# Altium schematic sheet PWR_REVE.SchDoc
size A4; SheetNumber: 1; SheetTotal: 2
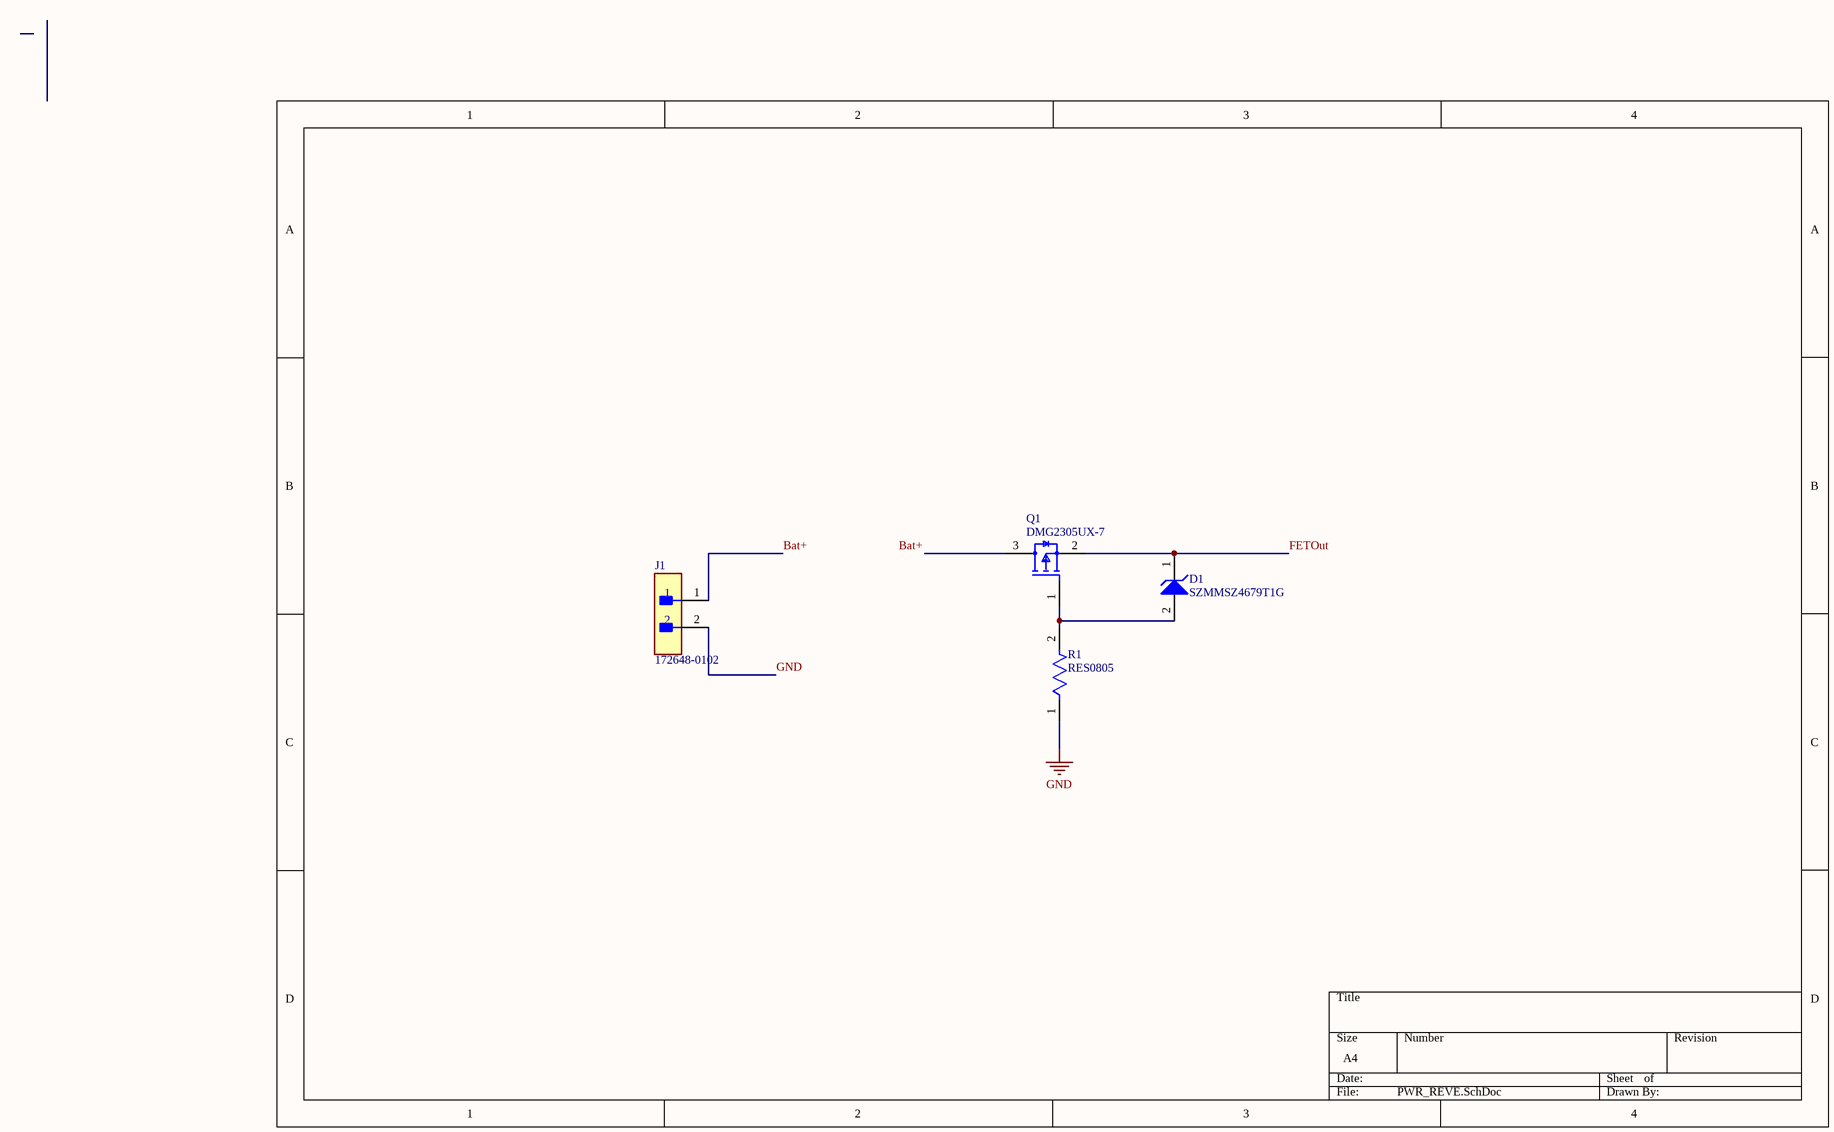
[diagram p0: PWR_REVE.SchDoc]

## Parts
D1  SZMMSZ4679T1G  [ONSC-SOD-123-2-425-04_V]
J1  172648-0102  [FP-172648-0102-MFG]
Q1  DMG2305UX-7  [FP-SOT23-IPC_B]
R1  RES0805  [FP-RMCF0805-IPC_C]

## Nets
GND: J1.2 R1.1
Bat+: J1.1 Q1.3(DRAIN)
FETOut: D1.1(K) Q1.2(SOURCE)
NetD1_2: D1.2(A) Q1.1(GATE) R1.2

## Library data of the parts
D1 = CMP-1060-00472-1: Zener Voltage Regulator, 500 mW, 2-Pin SOD-123, Pb-Free, Tape and Reel; Manufacturer: On Semiconductor; P Max (W): 0.5; VZ Typ (V): 2; ComponentLink3Description: Package Specification; Mounting Technology: Surface Mount; ComponentLink1URL: http://www.onsemi.com/; PackageVersion: Rev. G, 10/2009; ComponentLink3URL: http://www.onsemi.com/pub_link/Collateral/425-04.PDF; ComponentLink1Description: Manufacturer URL; ComponentLink2Description: Datasheet; PackageReference: SOD-123-2-425-04; PackageDescription: 2-Pin SOD, Body 1.6 x 2.69 mm; DatasheetVersion: Rev. 9; PartNumber: SZMMSZ4679T1G; ComponentLink2URL: http://www.onsemi.com/pub_link/Collateral/MMSZ4678T1-D.PDF; Packing: Tape and Reel; RoHS: Pb-Free
J1 = CMP-04776-000216-1: CONN HEADER R/A 2POS 4.2MM
Q1 = CMP-1693-00002-4: MOSFET P-CH 20V 4.2A SOT23; Turn-On Delay Time: 10.8ns; Turn-Off Delay Time: 79.3ns; Threshold Voltage: -900mV; Rise Time: 13.7ns; Gate to Source Voltage (Vgs): 8V; Rds On Max: 52mR; Element Configuration: Single; Fall Time: 34.7ns; Max Power Dissipation: 1.4W; Drain to Source Resistance: 200mR; Number of Channels: 1; Input Capacitance: 808pF; Lead Free: Lead Free; Number of Pins: 3; Length: 3mm; Continuous Drain Current (ID): 4.2A; Contact Plating: Tin; Mount: Surface Mount; Weight: 0.000282oz; Min Operating Temperature: -55°C; Package Quantity: 3000; Drain to Source Voltage (Vdss): 20V; On-State Resistance: 52MR; Max Operating Temperature: 150°C; Height: 1.1mm; REACH SVHC: No SVHC; Packaging: Tape and Reel; Radiation Hardening: No; Case/Package: SOT-23; Width: 1.4mm
R1 = CMP-26527-000066-1: 10kΩ; Temperature Coefficient: 200ppm/°C; Max Power Dissipation: 125mW; Tolerance: 5%; Resistance: 1MR; Construction: Rectangular; Case Code (Metric): 2012; Radiation Hardening: No; Contact Plating: Tin; Military Standard: Not; Features: Automotive AEC-Q200; Resistor Type: Thick Film; Series: RMCF; Length: 2mm; Min Operating Temperature: -55°C; Case Code (Imperial): 0805; Height: 0.026inch; Mount: Surface Mount; Max Operating Temperature: 155°C; Depth: 1.25mm; Width: 0.049inch; Packaging: Tape and Reel; Number of Terminations: 2; Case/Package: 0805; Lead Free: Lead Free; RoHS Compliant: Yes